# Altium schematic sheet 16X16点阵显示设计 - 硬件电路.SchDoc
size A2; SheetNumber: 0; SheetTotal: 0
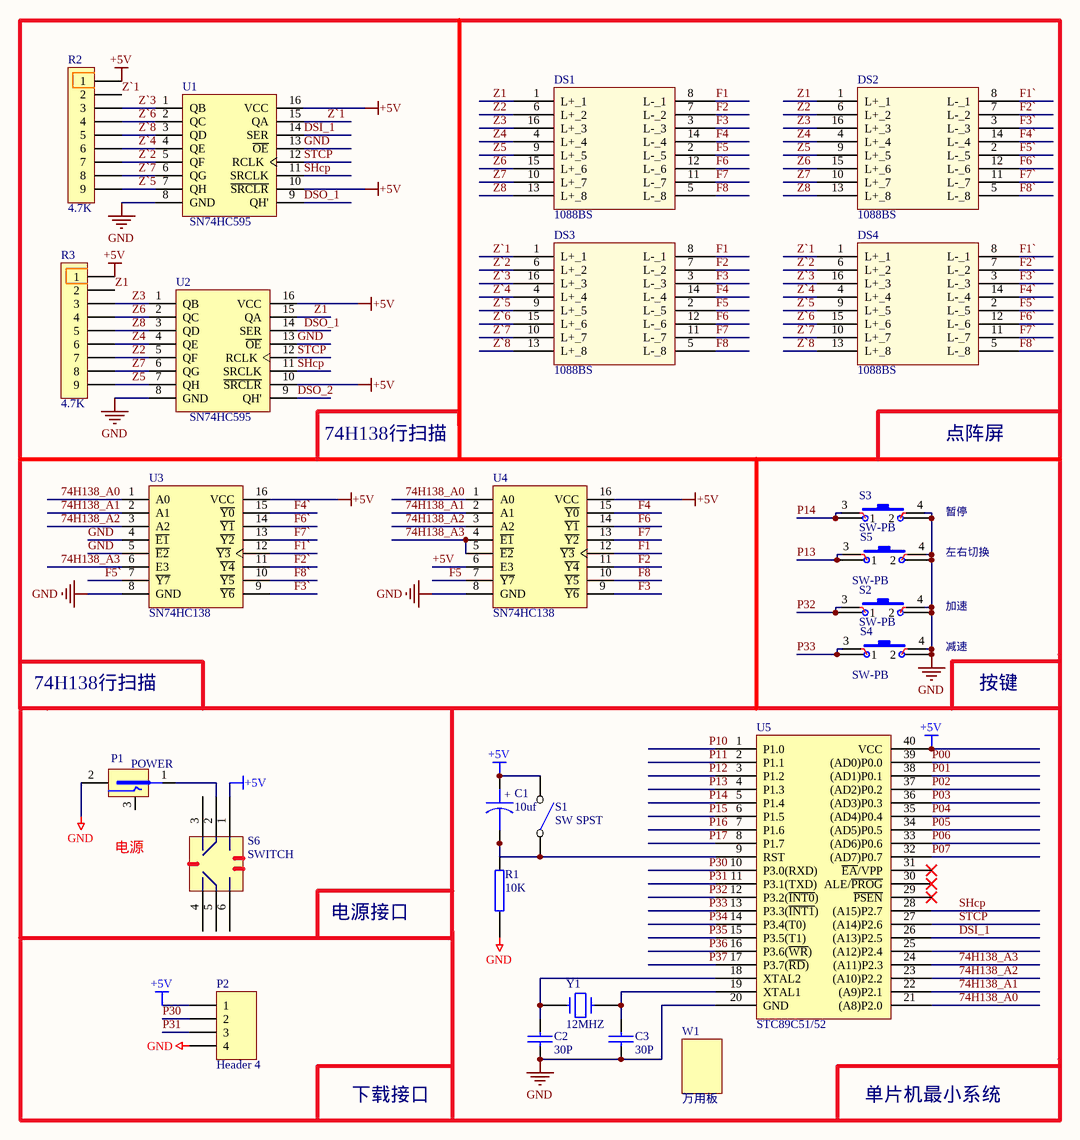
[diagram p0: 16X16点阵显示设计 - 硬件电路.SchDoc]

## Parts
C1  10uf  [RB-2.54/5MM]
C2  30P  [CAPR5-4X5]
C3  30P  [CAPR5-4X5]
DS1  1088BS  [LEDMatrix]
DS2  1088BS  [LEDMatrix]
DS3  1088BS  [LEDMatrix]
DS4  1088BS  [LEDMatrix]
P1  POWER  [DC002]
P2  Header 4  [HDR1X4]
R1  10K  [AXIAL-0.4]
R2  4.7K  [A09]
R3  4.7K  [A09]
S1  SW SPST  [SW6*6*5]
S2  SW-PB  [SW6*6*5]
S3  SW-PB  [SW6*6*5]
S4  SW-PB  [SW6*6*5]
S5  SW-PB  [SW6*6*5]
S6  SWITCH  [SW6]
U1  SN74HC595  [DIP16]
U2  SN74HC595  [DIP16]
U3  SN74HC138  [DIP16]
U4  SN74HC138  [DIP16]
U5  STC89C51/52  [DIP40]
W1  万用板  [万能板9X15cm第二版]
Y1  12MHZ  [XTAL1]

## Nets
+5V: C1.1 P2.1 R2.1 R3.1 S1.2(NO) S6.1 U1.10(~{SRCLR}) U1.16(VCC) U2.10(~{SRCLR}) U2.16(VCC) U3.16(VCC) U4.6(E3) U4.16(VCC) U5.40(VCC)
GND: C2.1 C3.1 P1.2 P2.4 R1.1 S2.2 S2.4 S3.2 S3.4 S4.2 S4.4 S5.2 S5.4 U1.8(GND) U1.13(~{OE}) U2.8(GND) U2.13(~{OE}) U3.4(~{E1}) U3.5(~{E2}) U3.8(GND) U4.8(GND) U5.20(GND)
74H138_A0: U3.1(A0) U4.1(A0) U5.21((A8)P2.0)
74H138_A1: U3.2(A1) U4.2(A1) U5.22((A9)P2.1)
74H138_A2: U3.3(A2) U4.3(A2) U5.23((A10)P2.2)
74H138_A3: U3.6(E3) U4.4(~{E1}) U4.5(~{E2}) U5.24((A11)P2.3)
DSI_1: U1.14(SER) U5.26((A13)P2.5)
DSO_1: U1.9(QH') U2.14(SER)
DSO_2: U2.9(QH')
F1: DS1.8(L-_1) DS3.8(L-_1) U4.12(~{Y3})
F1`: DS2.8(L-_1) DS4.8(L-_1) U3.12(~{Y3})
F2: DS1.7(L-_2) DS3.7(L-_2) U4.11(~{Y4})
F2`: DS2.7(L-_2) DS4.7(L-_2) U3.11(~{Y4})
F3: DS1.3(L-_3) DS3.3(L-_3) U4.9(~{Y6})
F3`: DS2.3(L-_3) DS4.3(L-_3) U3.9(~{Y6})
F4: DS1.14(L-_4) DS3.14(L-_4) U4.15(~{Y0})
F4`: DS2.14(L-_4) DS4.14(L-_4) U3.15(~{Y0})
F5: DS1.2(L-_5) DS3.2(L-_5) U4.7(~{Y7})
F5`: DS2.2(L-_5) DS4.2(L-_5) U3.7(~{Y7})
F6: DS1.12(L-_6) DS3.12(L-_6) U4.14(~{Y1})
F6`: DS2.12(L-_6) DS4.12(L-_6) U3.14(~{Y1})
F7: DS1.11(L-_7) DS3.11(L-_7) U4.13(~{Y2})
F7`: DS2.11(L-_7) DS4.11(L-_7) U3.13(~{Y2})
F8: DS1.5(L-_8) DS3.5(L-_8) U4.10(~{Y5})
F8`: DS2.5(L-_8) DS4.5(L-_8) U3.10(~{Y5})
P00: U5.39((AD0)P0.0)
P01: U5.38((AD1)P0.1)
P02: U5.37((AD2)P0.2)
P03: U5.36((AD3)P0.3)
P04: U5.35((AD4)P0.4)
P05: U5.34((AD5)P0.5)
P06: U5.33((AD6)P0.6)
P07: U5.32((AD7)P0.7)
P10: U5.1(P1.0)
P11: U5.2(P1.1)
P12: U5.3(P1.2)
P13: S5.1 S5.3 U5.4(P1.3)
P14: S3.1 S3.3 U5.5(P1.4)
P15: U5.6(P1.5)
P16: U5.7(P1.6)
P17: U5.8(P1.7)
P30: P2.2 U5.10(P3.0(RXD))
P31: P2.3 U5.11(P3.1(TXD))
P32: S2.1 S2.3 U5.12(P3.2(~{INT0}))
P33: S4.1 S4.3 U5.13(P3.3(~{INT1}))
P34: U5.14(P3.4(T0))
P35: U5.15(P3.5(T1))
P36: U5.16(P3.6(~{WR}))
P37: U5.17(P3.7(~{RD}))
SHcp: U1.11(SRCLK) U2.11(SRCLK) U5.28((A15)P2.7)
STCP: U1.12(RCLK) U2.12(RCLK) U5.27((A14)P2.6)
Z1: DS1.1(L+_1) DS2.1(L+_1) R3.2 U2.15(QA)
Z2: DS1.6(L+_2) DS2.6(L+_2) R3.7 U2.5(QF)
Z3: DS1.16(L+_3) DS2.16(L+_3) R3.3 U2.1(QB)
Z4: DS1.4(L+_4) DS2.4(L+_4) R3.6 U2.4(QE)
Z5: DS1.9(L+_5) DS2.9(L+_5) R3.9 U2.7(QH)
Z6: DS1.15(L+_6) DS2.15(L+_6) R3.4 U2.2(QC)
Z7: DS1.10(L+_7) DS2.10(L+_7) R3.8 U2.6(QG)
Z8: DS1.13(L+_8) DS2.13(L+_8) R3.5 U2.3(QD)
Z`1: DS3.1(L+_1) DS4.1(L+_1) R2.2 U1.15(QA)
Z`2: DS3.6(L+_2) DS4.6(L+_2) R2.7 U1.5(QF)
Z`3: DS3.16(L+_3) DS4.16(L+_3) R2.3 U1.1(QB)
Z`4: DS3.4(L+_4) DS4.4(L+_4) R2.6 U1.4(QE)
Z`5: DS3.9(L+_5) DS4.9(L+_5) R2.9 U1.7(QH)
Z`6: DS3.15(L+_6) DS4.15(L+_6) R2.4 U1.2(QC)
Z`7: DS3.10(L+_7) DS4.10(L+_7) R2.8 U1.6(QG)
Z`8: DS3.13(L+_8) DS4.13(L+_8) R2.5 U1.3(QD)
NetC1_2: C1.2 R1.2 S1.1(COMMON) U5.9(RST)
NetC2_2: C2.2 U5.18(XTAL2) Y1.1
NetC3_2: C3.2 U5.19(XTAL1) Y1.2
NetP1_1: P1.1 S6.2

Not connected (* = marked no-connect by the designer): P1 3; S6 3 4 5 6; U5 25((A12)P2.4) 29(~{PSEN})* 30(ALE/~{PROG})* 31(~{EA}/VPP)*

## Notes on the sheet
- 74H138行扫描
- 点阵屏
- 暂停
- 左右切换
- 加速
- 减速
- 按键
- (near P1) 电源
- 电源接口
- 下载接口
- 单片机最小系统
- (in symbol CAPACITOR POL) +

## Library data of the parts
C1 = CAPACITOR POL: Capacitor
C2 C3 = CAP: Capacitor
DS1-DS4 = LEDMatrix: LED8*8点阵
P2 = Header 4: Header, 4-Pin; LatestRevisionDate: 17-Jul-2002; LatestRevisionNote: Re-released for DXP Platform.; Publisher: Altium Limited
R1 = RES2
R2 R3 = RES_A09: 9脚排阻
S2-S5 = SW-PB: 按键6X6X5MM; Published: 24-Mar-1999; LatestRevisionDate: 17-Jul-2002; LatestRevisionNote: Re-released for DXP Platform.; PackageReference: SPST-2; Publisher: Altium Limited
U1 U2 = SN74HC595D: 8-Bit Shift Register with 3-State Output Registers; name: 集成模块（SMD）; Published: 8-Jun-2000; LatestRevisionDate: 13-Apr-2006; LatestRevisionNote: IPC-7351 Footprint Added.; DatasheetVersion: May-1997; PackageVersion: Jan-1998; PackageReference: D016; Publisher: Altium Limited; PackageDescription: 16-Pin Small Outline Integrated Circuit 1.27 mm Pitch; Code_IPC: SOIC127P600-16; ComponentLink1Description: Manufacturer Link; ComponentLink1URL: http://www.ti.com/; ComponentLink2Description: Datasheet; ComponentLink2URL: http://www-s.ti.com/sc/ds/sn74hc595.pdf
U3 U4 = SN74HC138: 8-Bit Shift Register with 3-State Output Registers; name: 集成模块（SMD）; Published: 8-Jun-2000; LatestRevisionDate: 13-Apr-2006; LatestRevisionNote: IPC-7351 Footprint Added.; DatasheetVersion: May-1997; PackageVersion: Jan-1998; PackageReference: D016; Publisher: Altium Limited; PackageDescription: 16-Pin Small Outline Integrated Circuit 1.27 mm Pitch; Code_IPC: SOIC127P600-16; ComponentLink1Description: Manufacturer Link; ComponentLink1URL: http://www.ti.com/; ComponentLink2Description: Datasheet; ComponentLink2URL: http://www-s.ti.com/sc/ds/sn74hc595.pdf
U5 = STC89C51: 51单片机
Y1 = CRYSTAL